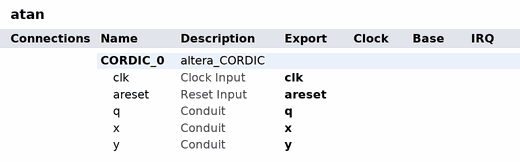
[diagram p0: system contents]
# Platform Designer (Qsys) system atan, Cyclone V 5CSEMA5F31C6
# Parameters at their usual value, and those the tool derives, are not listed.
package require -exact qsys 18.0
create_system atan
set_project_property DEVICE_FAMILY {Cyclone V}
set_project_property DEVICE 5CSEMA5F31C6

add_instance CORDIC_0 altera_CORDIC 18.0
set_instance_property CORDIC_0 AUTO_EXPORT true
set_instance_parameter_value CORDIC_0 ALL_function ATAN2
set_instance_parameter_value CORDIC_0 FUNCTION_FAMILY ALL
set_instance_parameter_value CORDIC_0 LUTSize 6
set_instance_parameter_value CORDIC_0 SFCompensation false
set_instance_parameter_value CORDIC_0 frequency_target 50
set_instance_parameter_value CORDIC_0 fxpt_in_fraction 0
set_instance_parameter_value CORDIC_0 fxpt_in_sign 0
set_instance_parameter_value CORDIC_0 fxpt_in_width 12
set_instance_parameter_value CORDIC_0 fxpt_out_fraction 7
set_instance_parameter_value CORDIC_0 fxpt_out_width 32
set_instance_parameter_value CORDIC_0 gen_enable false
set_instance_parameter_value CORDIC_0 latency_target 2
set_instance_parameter_value CORDIC_0 performance_goal frequency
set_instance_parameter_value CORDIC_0 report_resources_to_xml false
set_instance_parameter_value CORDIC_0 selected_device_family {Cyclone V}
set_instance_parameter_value CORDIC_0 selected_device_speedgrade 6
set_instance_parameter_value CORDIC_0 specifyLUTs false
set_instance_parameter_value CORDIC_0 useLUTs false

# exported interfaces
add_interface areset reset sink
set_interface_property areset EXPORT_OF CORDIC_0.areset
add_interface clk clock sink
set_interface_property clk EXPORT_OF CORDIC_0.clk
add_interface q conduit end
set_interface_property q EXPORT_OF CORDIC_0.q
add_interface x conduit end
set_interface_property x EXPORT_OF CORDIC_0.x
add_interface y conduit end
set_interface_property y EXPORT_OF CORDIC_0.y

set_interconnect_requirement {$system} qsys_mm.clockCrossingAdapter HANDSHAKE
set_interconnect_requirement {$system} qsys_mm.enableEccProtection FALSE
set_interconnect_requirement {$system} qsys_mm.insertDefaultSlave FALSE
set_interconnect_requirement {$system} qsys_mm.maxAdditionalLatency 1

save_system atan.qsys
